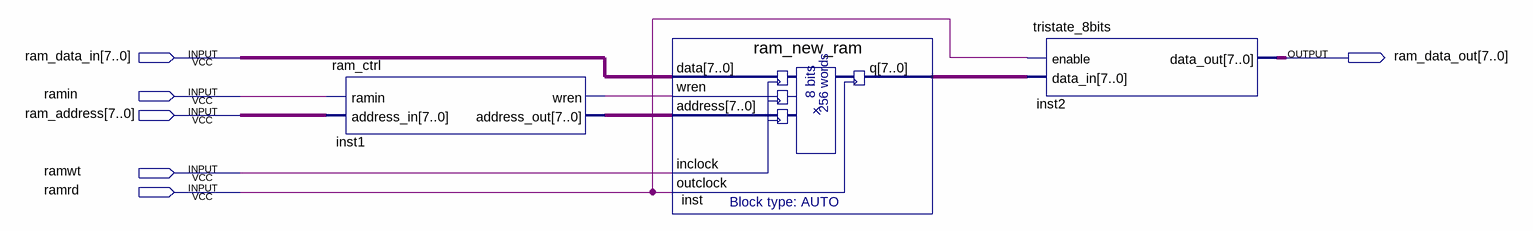
[diagram p0: schematic sheet]
// Quartus schematic ram_new.bdf as structural Verilog: 3 symbols, 6 pins
module ram_new (
  input  [7:0] ram_data_in,
  input  ramin,
  input  [7:0] ram_address,
  input  ramwt,
  input  ramrd,
  output [7:0] ram_data_out
);

  wire inst1_wren;
  wire [7:0] inst1_address_out, inst_q;

  ram_ctrl inst1 (.ramin(ramin), .address_in(ram_address), .wren(inst1_wren), .address_out(inst1_address_out));
  ram_new_ram inst (
    .data(ram_data_in), .wren(inst1_wren), .address(inst1_address_out), .inclock(ramwt), .outclock(ramrd),
    .q(inst_q));
  tristate_8bits inst2 (.enable(ramrd), .data_in(inst_q), .data_out(ram_data_out));
endmodule
